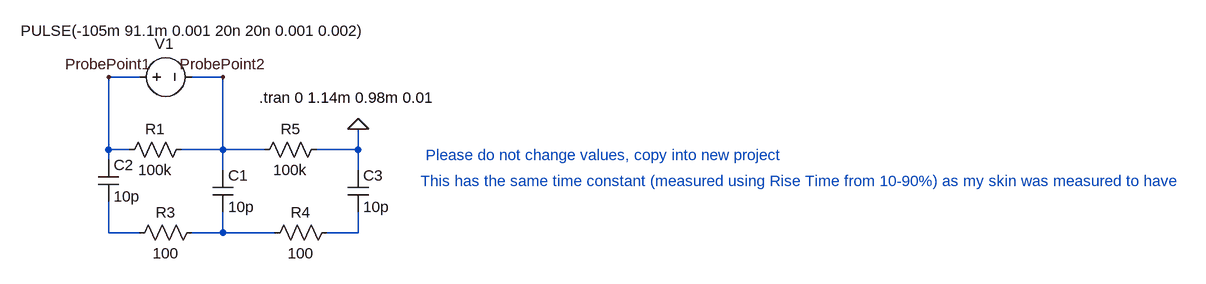
[diagram p0: schematic PerfectTimeConstantMatch.asc]
PerfectTimeConstantMatch.asc, the LTspice schematic file:
Version 4
SHEET 1 1904 680
WIRE 176 -16 128 -16
WIRE 304 -16 256 -16
WIRE 128 96 128 -16
WIRE 160 96 128 96
WIRE 304 96 304 -16
WIRE 304 96 240 96
WIRE 368 96 304 96
WIRE 512 96 512 64
WIRE 512 96 448 96
WIRE 128 112 128 96
WIRE 304 128 304 96
WIRE 512 128 512 96
WIRE 128 224 128 176
WIRE 176 224 128 224
WIRE 304 224 304 192
WIRE 304 224 256 224
WIRE 384 224 304 224
WIRE 512 224 512 192
WIRE 512 224 464 224
FLAG 512 64 0
FLAG 128 -16 ProbePoint1
FLAG 304 -16 ProbePoint2
SYMBOL res 256 80 R90
WINDOW 0 0 56 VBottom 2
WINDOW 3 32 56 VTop 2
SYMATTR InstName R1
SYMATTR Value 100k
SYMBOL cap 288 128 R0
SYMATTR InstName C1
SYMATTR Value 10p
SYMBOL voltage 160 -16 R270
WINDOW 3 71 -167 VRight 2
WINDOW 123 0 0 Left 0
WINDOW 39 0 0 Left 0
WINDOW 0 51 39 VRight 2
SYMATTR Value PULSE(-105m 91.1m 0.001 20n 20n 0.001 0.002)
SYMATTR InstName V1
SYMBOL cap 112 112 R0
SYMATTR InstName C2
SYMATTR Value 10p
SYMBOL res 272 208 R90
WINDOW 0 0 56 VBottom 2
WINDOW 3 32 56 VTop 2
SYMATTR InstName R3
SYMATTR Value 100
SYMBOL res 480 208 R90
WINDOW 0 0 56 VBottom 2
WINDOW 3 32 56 VTop 2
SYMATTR InstName R4
SYMATTR Value 100
SYMBOL cap 496 128 R0
SYMATTR InstName C3
SYMATTR Value 10p
SYMBOL res 464 80 R90
WINDOW 0 0 56 VBottom 2
WINDOW 3 32 56 VTop 2
SYMATTR InstName R5
SYMATTR Value 100k
TEXT 360 16 Left 2 !.tran 0 1.14m 0.98m 0.01
TEXT 616 104 Left 2 ;Please do not change values, copy into new project
TEXT 608 144 Left 2 ;This has the same time constant (measured using Rise Time from 10-90%) as my skin was measured to have

The netlist it stands for:
* PerfectTimeConstantMatch.asc
R1 ProbePoint2 ProbePoint1 100k
C1 ProbePoint2 N002 10p
V1 ProbePoint1 ProbePoint2 PULSE(-105m 91.1m 0.001 20n 20n 0.001 0.002)
C2 ProbePoint1 N001 10p
R3 N002 N001 100
R4 N003 N002 100
C3 0 N003 10p
R5 0 ProbePoint2 100k
.tran 0 1.14m 0.98m 0.01
* Please do not change values, copy into new project
* This has the same time constant (measured using Rise Time from 10-90%) as my skin was measured to have
.backanno
.end